# Altium schematic sheet voltage_conditioning.SchDoc
size A4
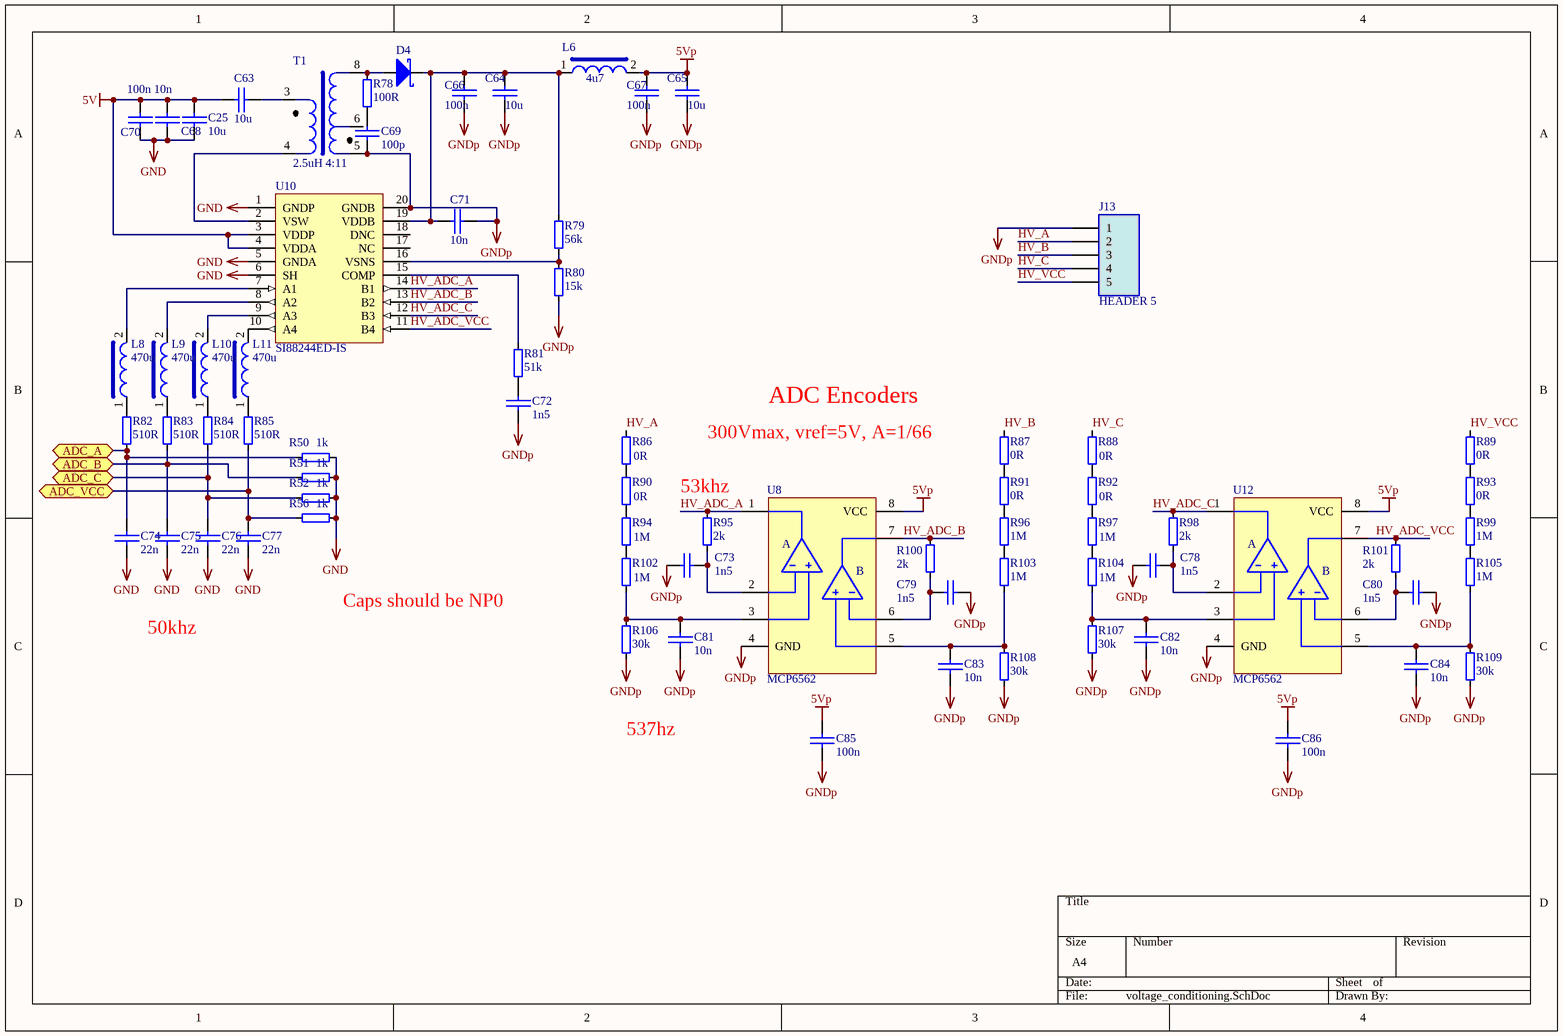
[diagram p0: voltage_conditioning.SchDoc]

## Parts
C25  10u  [0805]
C63  10u  [0805]
C64  10u  [0805]
C65  10u  [0805]
C66  100n  [0603]
C67  100n  [0603]
C68  10n  [0603]
C69  100p  [0603]
C70  100n  [0603]
C71  10n  [0603]
C72  1n5  [0603]
C73  1n5  [0603]
C74  22n  [0603]
C75  22n  [0603]
C76  22n  [0603]
C77  22n  [0603]
C78  1n5  [0603]
C79  1n5  [0603]
C80  1n5  [0603]
C81  10n  [0603]
C82  10n  [0603]
C83  10n  [0603]
C84  10n  [0603]
C85  100n  [0603]
C86  100n  [0603]
D4  DIODE SCHOTTKY  [SOD323-AK]  (value not drawn)
J13  HEADER 5  [HDR5-5mm]
L6  4u7  [0805]
L8  470u  [0805]
L9  470u  [0805]
L10  470u  [0805]
L11  470u  [0805]
R50  1k  [0603]
R51  1k  [0603]
R52  1k  [0603]
R56  1k  [0603]
R78  100R  [0603]
R79  56k  [0603]
R80  15k  [0603]
R81  51k  [0603]
R82  510R  [0603]
R83  510R  [0603]
R84  510R  [0603]
R85  510R  [0603]
R86  0R  [1206]
R87  0R  [1206]
R88  0R  [1206]
R89  0R  [1206]
R90  0R  [1206]
R91  0R  [1206]
R92  0R  [1206]
R93  0R  [1206]
R94  1M  [1206]
R95  2k  [0603]
R96  1M  [1206]
R97  1M  [1206]
R98  2k  [0603]
R99  1M  [1206]
R100  2k  [0603]
R101  2k  [0603]
R102  1M  [1206]
R103  1M  [1206]
R104  1M  [1206]
R105  1M  [1206]
R106  30k  [0603]
R107  30k  [0603]
R108  30k  [0603]
R109  30k  [0603]
T1  2.5uH 4:11  [RM5/I]
U8  MCP6562  [MSOP8]
U10  SI88244ED-IS  [SLAB-SOIC-20-WB_N]
U12  MCP6562  [MSOP8]

## Ports
ADC_A, ADC_B, ADC_C, ADC_VCC

## Nets
5V: C25.2 C63.1 C68.1 C70.1 U10.3(VDDP) U10.4(VDDA)
5Vp: C65.1 C67.1 C85.1 C86.1 L6.2 U8.8(VCC) U12.8(VCC)
GND: C25.1 C68.2 C70.2 C74.1 C75.1 C76.1 C77.1 R50.1 R51.1 R52.1 R56.1 U10.1(GNDP) U10.5(GNDA) U10.6(SH)
GNDp: C64.2 C65.2 C66.2 C67.2 C69.2 C71.2 C72.2 C73.1 C78.1 C79.1 C80.1 C81.1 C82.1 C83.2 C84.2 C85.2 C86.2 J13.1 R80.2 R106.1 R107.1 R108.2 R109.2 T1.5 U8.4(GND) U10.20(GNDB) U12.4(GND)
ADC_A: C74.2 R50.2 R82.1 ; port ADC_A
ADC_B: C75.2 R51.2 R83.1 ; port ADC_B
ADC_C: C76.2 R52.2 R84.1 ; port ADC_C
ADC_VCC: C77.2 R56.2 R85.1 ; port ADC_VCC
HV_A: J13.2 R86.2
HV_ADC_A: R95.2 U8.1(OUTA) U10.14(B1)
HV_ADC_B: R100.2 U8.7(OUTB) U10.13(B2)
HV_ADC_C: R98.2 U10.12(B3) U12.1(OUTA)
HV_ADC_VCC: R101.2 U10.11(B4) U12.7(OUTB)
HV_B: J13.3 R87.2
HV_C: J13.4 R88.2
HV_VCC: J13.5 R89.2
NetC63_2: C63.2 T1.3
NetC64_1: C64.1 C66.1 C71.1 D4.K L6.1 R79.2 U10.19(VDDB)
NetC69_1: C69.1 R78.1
NetC72_1: C72.1 R81.1
NetC73_2: C73.2 R95.1 U8.2(-A)
NetC78_2: C78.2 R98.1 U12.2(-A)
NetC79_2: C79.2 R100.1 U8.6(-B)
NetC80_2: C80.2 R101.1 U12.6(-B)
NetC81_2: C81.2 R102.1 R106.2 U8.3(+A)
NetC82_2: C82.2 R104.1 R107.2 U12.3(+A)
NetC83_1: C83.1 R103.1 R108.1 U8.5(+B)
NetC84_1: C84.1 R105.1 R109.1 U12.5(+B)
NetD4_A: D4.A R78.2 T1.8
NetL8_1: L8.1 R82.2
NetL8_2: L8.2 U10.7(A1)
NetL9_1: L9.1 R83.2
NetL9_2: L9.2 U10.8(A2)
NetL10_1: L10.1 R84.2
NetL10_2: L10.2 U10.9(A3)
NetL11_1: L11.1 R85.2
NetL11_2: L11.2 U10.10(A4)
NetR79_1: R79.1 R80.1 U10.16(VSNS)
NetR81_2: R81.2 U10.15(COMP)
NetR86_1: R86.1 R90.2
NetR87_1: R87.1 R91.2
NetR88_1: R88.1 R92.2
NetR89_1: R89.1 R93.2
NetR90_1: R90.1 R94.2
NetR91_1: R91.1 R96.2
NetR92_1: R92.1 R97.2
NetR93_1: R93.1 R99.2
NetR94_1: R94.1 R102.2
NetR96_1: R96.1 R103.2
NetR97_1: R97.1 R104.2
NetR99_1: R99.1 R105.2
NetT1_4: T1.4 U10.2(VSW)

Not connected (* = marked no-connect by the designer): T1 6; U10 17(NC) 18(DNC)

## Notes on the sheet
- 300Vmax, vref=5V, A=1/66
- ADC Encoders
- (near R95) 53khz
- 50khz
- Caps should be NP0
- 537hz
- (in symbol COMPARATOR DUAL draft) A; B

## Library data of the parts
C25 C63-C68 C70 C71 C74-C77 C79-C84 = CAP: Capacitor
  C25 C63-C68 C70 C71 C74-C77: Status: Draft
  C79-C84: Supplier 1: Digi-Key
C69 C72 = CAP: Manufacturer 1: Murata GRM188R71H103KA01D; Parameter: 10n, 0603, 50V, <20%, X7R Ceramic; Digikey Part Number: PCC2153CT-ND; Manufacturer 2: AVX	06035C103KAT2A; Manufacturer 3: TDK  C1608X7R1H103J
C73 C78 = CAP: COG/NPO; Supplier 1: Digi-Key
C85 C86 = CAP: Supplier 1: Digi-Key
D4 = DIODE SCHOTTKY: Schottky Diode; Status: Draft
J13 = HEADER 5: 4 Pin Header; Status: Draft
L6 = INDUCTOR-1 COIL: Standard single coil inductor; Manufacturer 1: Taiyo Yuden  LBR2012T4R7M; Parameter: Inductor, 4u7, 20%, >100mA; Manufacturer 2: Abracon 	AIML-0805-4R7K-T; Manufacturer 3: Bourns 	CV201210-4R7K; Status: Draft; Digikey Part Number: 587-2907-1-ND; Manufacturer 4: TDK MLZ2012N4R7L
L8-L11 = INDUCTOR-1 COIL: Standard single coil inductor; Parameter: 470uH 80mA; Supplier 1: Digi-Key; Supplier Part Number 1: 587-3061-1-ND
R50-R52 R56 R80 R82-R85 R106 R107 = RESISTOR: Parameter: *
  R50-R52 R56 R82-R85 R106 R107: Supplier 1: Digi-Key
  R80: Status: Draft
R78 R79 R81 R95 R98 R100 R101 R108 R109 = RES4: Resistor; Parameter: *
  R78 R79 R81: Status: Draft
  R95 R98 R100 R101 R108 R109: Supplier 1: Digi-Key
R86-R94 R96 R97 R99 R102-R105 = RES4: Resistor; Parameter: High Voltage; Supplier Part Number 1: RHM1MAICT-ND; Supplier 1: Digi-Key
T1 = TRANSFORMER-2 COIL 1L 1R_1t: 2Coil Transformer 1 on left 1 on right with tap; Phasing: *; Parameter: *; Manufacturer 1: *; Manufacturer 2: *; Manufacturer 3: *; Status: Draft
U8 U12 = COMPARATOR DUAL draft: Supplier Part Number 1: MCP6562T-E/MSCT-ND; Supplier 1: Digi-Key
U10 = SI88243ED-IS: Low-Power Quad-Channel Digital Isolator, 100 Mbps, 1 kVRMS Isolation Rating, -40 to 125 degC, 16-pin SOIC; Manufacturer: Silicon Labs; Supplier 1: Digi-Key; Supplier Part Number 1: 336-3242-ND; PartNumber: SI88243ED-IS